# Altium schematic sheet 08-I225-1.SchDoc
size A3; SheetNumber: 7; SheetTotal: 15
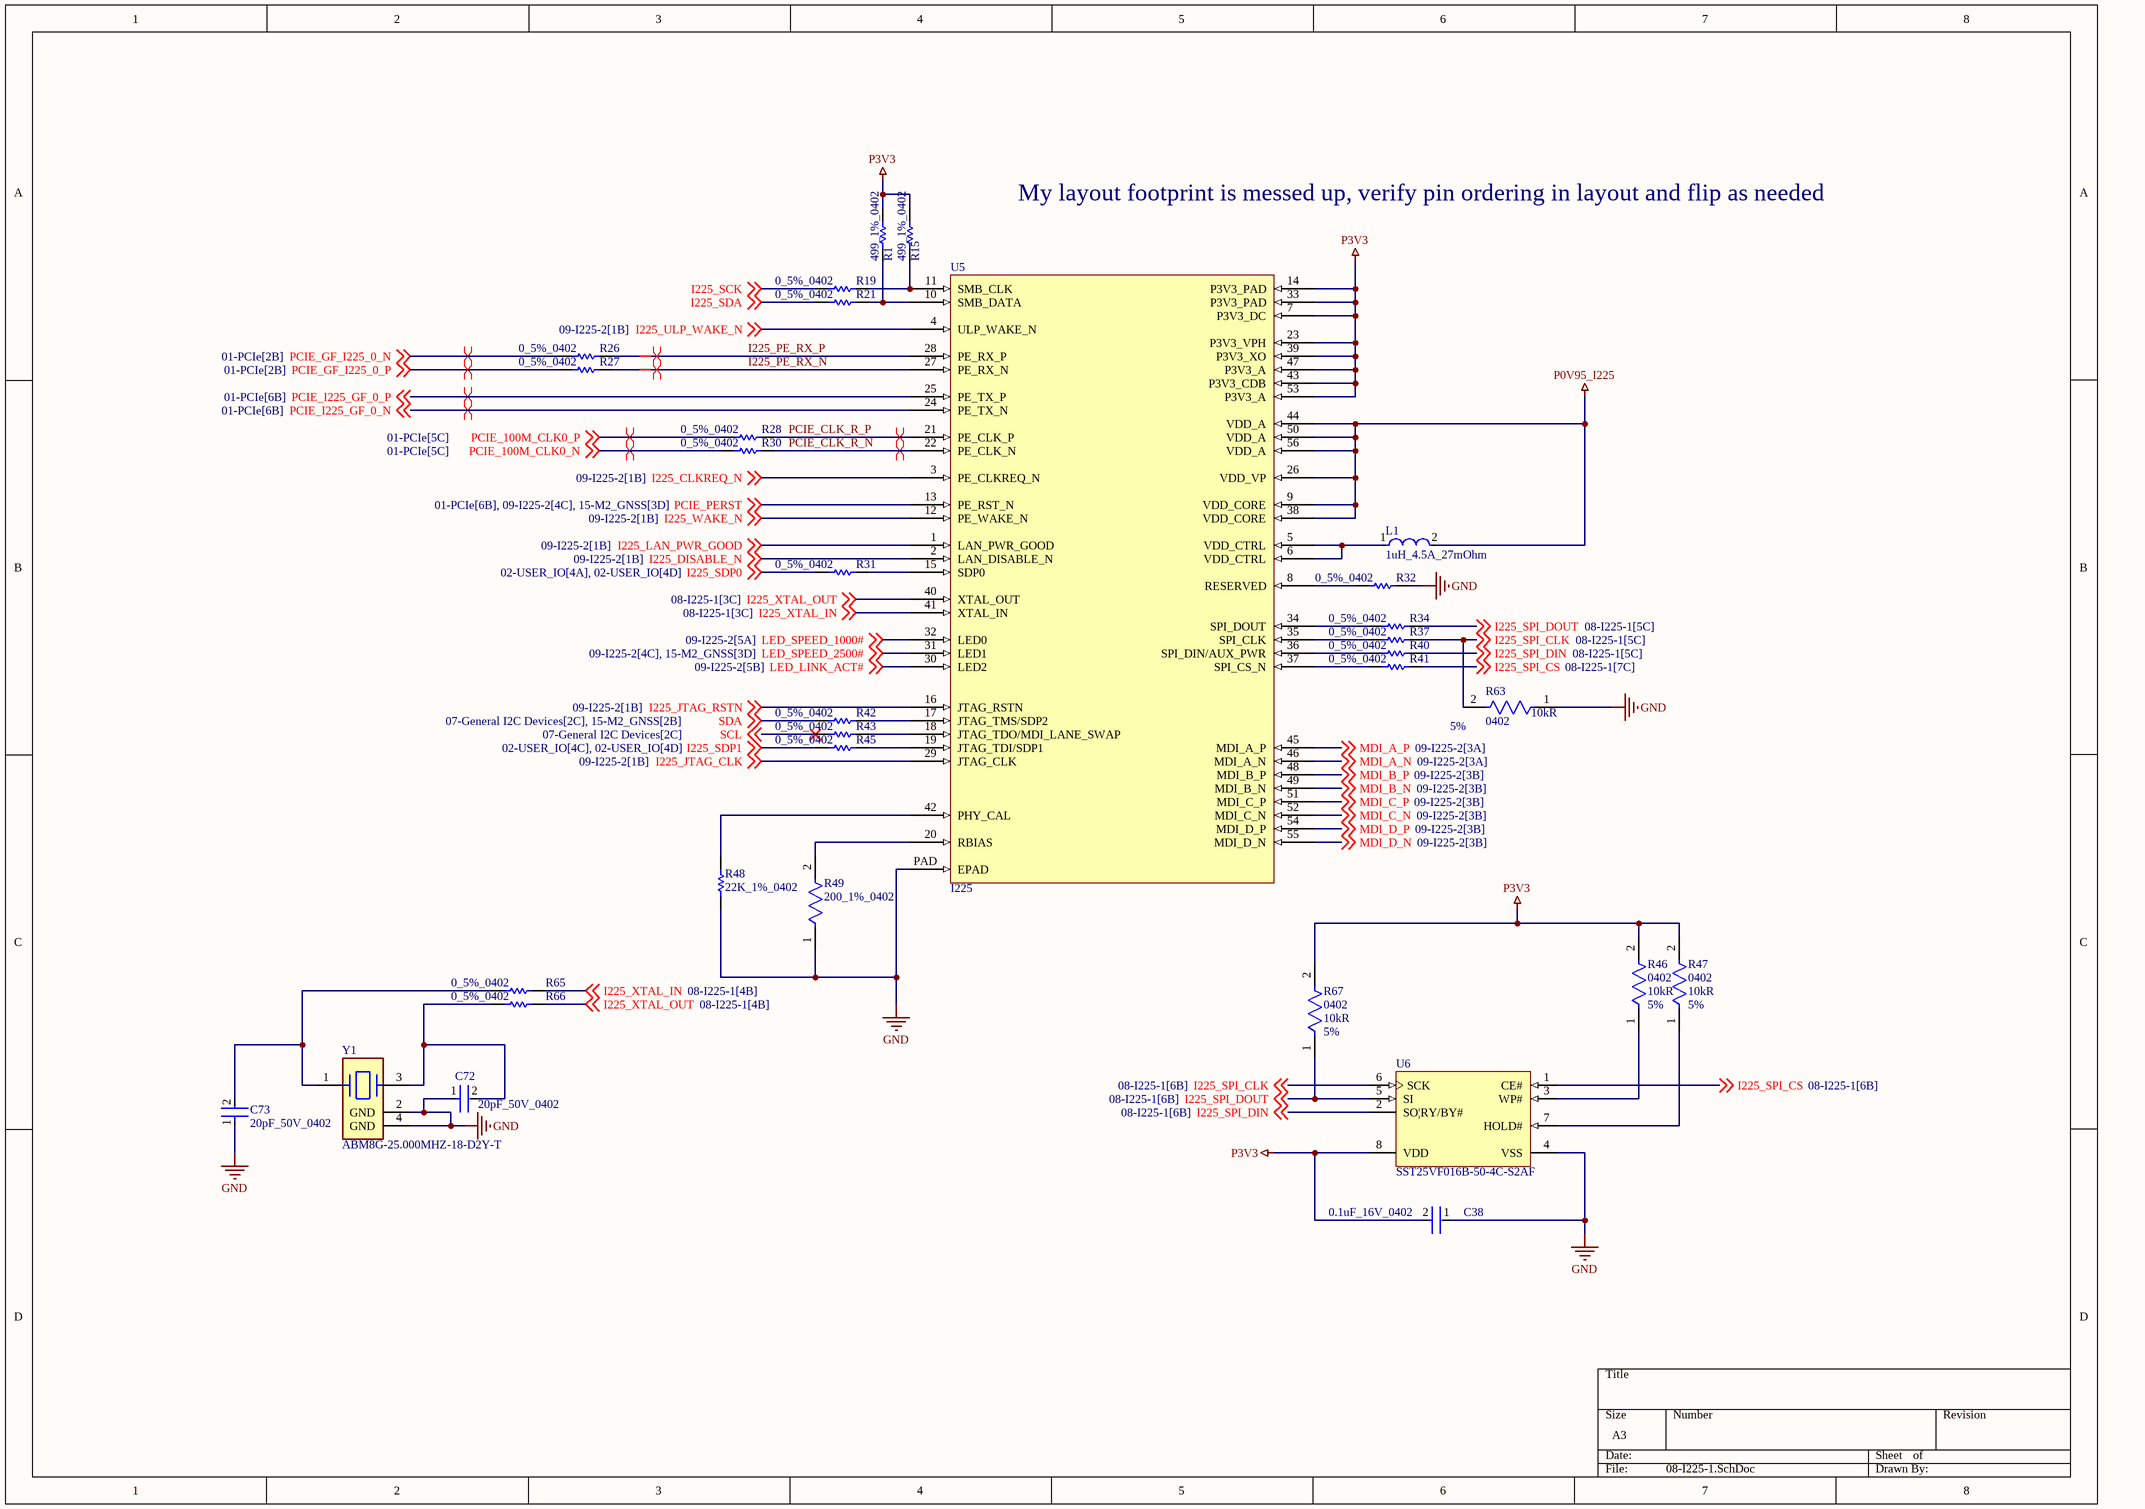
[diagram p0: 08-I225-1.SchDoc]

## Parts
C38  0.1uF_16V_0402  [FP-GRM15-MFG]
C72  20pF_50V_0402  [FP-C0402-BB-MFG]
C73  20pF_50V_0402  [FP-C0402-BB-MFG]
L1  1uH_4.5A_27mOhm  [FP-IHLP-1616BZ-FP_1_8545x-MFG]
R1  499_1%_0402  [RESC1005X40X25LL05T05]
R15  499_1%_0402  [RESC1005X40X25LL05T05]
R19  0_5%_0402  [RESC1005X40X25LL10T10]
R21  0_5%_0402  [RESC1005X40X25LL10T10]
R26  0_5%_0402  [RESC1005X40X25LL10T10]
R27  0_5%_0402  [RESC1005X40X25LL10T10]
R28  0_5%_0402  [RESC1005X40X25LL10T10]
R30  0_5%_0402  [RESC1005X40X25LL10T10]
R31  0_5%_0402  [RESC1005X40X25LL10T10]
R32  0_5%_0402  [RESC1005X40X25LL10T10]
R34  0_5%_0402  [RESC1005X40X25LL10T10]
R37  0_5%_0402  [RESC1005X40X25LL10T10]
R40  0_5%_0402  [RESC1005X40X25LL10T10]
R41  0_5%_0402  [RESC1005X40X25LL10T10]
R42  0_5%_0402  [RESC1005X40X25LL10T10]
R43  0_5%_0402  [RESC1005X40X25LL10T10]
R45  0_5%_0402  [RESC1005X40X25LL10T10]
R46  Case/Package: 0402  Resistance: 10kR  Tolerance: 5%  [FP-CRCW0402-e3-IPC_B]  (hidden comment: CRCW040210K0JNED)
R47  Case/Package: 0402  Resistance: 10kR  Tolerance: 5%  [FP-CRCW0402-e3-IPC_B]  (hidden comment: CRCW040210K0JNED)
R48  22K_1%_0402  [RESC1005X40X25NL05T05]
R49  200_1%_0402  [FP-CRCW0402-e3-IPC_C]
R63  Case/Package: 0402  Resistance: 10kR  Tolerance: 5%  [FP-CRCW0402-e3-IPC_B]  (hidden comment: CRCW040210K0JNED)
R65  0_5%_0402  [RESC1005X40X25LL10T10]
R66  0_5%_0402  [RESC1005X40X25LL10T10]
R67  Case/Package: 0402  Resistance: 10kR  Tolerance: 5%  [FP-CRCW0402-e3-IPC_B]  (hidden comment: CRCW040210K0JNED)
U5  I225  [I225 QFN56]
U6  SST25VF016B-50-4C-S2AF  [MCHP-SOIC-S2A8_M]
Y1  ABM8G-25.000MHZ-18-D2Y-T  [FP-ABM8G-MFG]

## Nets
GND: C38.1 C72.1 C73.1 R32.2 R48.1 R49.1 R63.1 U5.PAD(EPAD) U6.4(VSS) Y1.2(GND) Y1.4(GND)
P0V95_I225: L1.2 U5.9(VDD_CORE) U5.26(VDD_VP) U5.38(VDD_CORE) U5.44(VDD_A) U5.50(VDD_A) U5.56(VDD_A)
P3V3: C38.2 R1.2 R15.2 R46.2 R47.2 R67.2 U5.7(P3V3_DC) U5.14(P3V3_PAD) U5.23(P3V3_VPH) U5.33(P3V3_PAD) U5.39(P3V3_XO) U5.43(P3V3_CDB) U5.47(P3V3_A) U5.53(P3V3_A) U6.8(VDD)
I225_CLKREQ_N: U5.3(PE_CLKREQ_N) ; off-sheet I225_CLKREQ_N
I225_DISABLE_N: U5.2(LAN_DISABLE_N) ; off-sheet I225_DISABLE_N
I225_JTAG_CLK: U5.29(JTAG_CLK) ; off-sheet I225_JTAG_CLK
I225_JTAG_RSTN: U5.16(JTAG_RSTN) ; off-sheet I225_JTAG_RSTN
I225_LAN_PWR_GOOD: U5.1(LAN_PWR_GOOD) ; off-sheet I225_LAN_PWR_GOOD
I225_PE_RX_N: R27.2 U5.27(PE_RX_N)
I225_PE_RX_P: R26.2 U5.28(PE_RX_P)
I225_SCK: R19.1 ; off-sheet I225_SCK
I225_SDA: R21.1 ; off-sheet I225_SDA
I225_SDP0: R31.1 ; off-sheet I225_SDP0
I225_SDP1: R45.1 ; off-sheet I225_SDP1
I225_SPI_CLK: R37.2 R63.2 U6.6(SCK) ; off-sheet I225_SPI_CLK
I225_SPI_CS: R41.2 U6.1(CE#) ; off-sheet I225_SPI_CS
I225_SPI_DIN: R40.2 U6.2(SO|RY/BY#) ; off-sheet I225_SPI_DIN
I225_SPI_DOUT: R34.2 R67.1 U6.5(SI) ; off-sheet I225_SPI_DOUT
I225_ULP_WAKE_N: U5.4(ULP_WAKE_N) ; off-sheet I225_ULP_WAKE_N
I225_WAKE_N: U5.12(PE_WAKE_N) ; off-sheet I225_WAKE_N
I225_XTAL_IN: R65.2 U5.41(XTAL_IN) ; off-sheet I225_XTAL_IN
I225_XTAL_OUT: R66.2 U5.40(XTAL_OUT) ; off-sheet I225_XTAL_OUT
LED_LINK_ACT#: U5.30(LED2) ; off-sheet LED_LINK_ACT#
LED_SPEED_1000#: U5.32(LED0) ; off-sheet LED_SPEED_1000#
LED_SPEED_2500#: U5.31(LED1) ; off-sheet LED_SPEED_2500#
MDI_A_N: U5.46(MDI_A_N) ; off-sheet MDI_A_N
MDI_A_P: U5.45(MDI_A_P) ; off-sheet MDI_A_P
MDI_B_N: U5.49(MDI_B_N) ; off-sheet MDI_B_N
MDI_B_P: U5.48(MDI_B_P) ; off-sheet MDI_B_P
MDI_C_N: U5.52(MDI_C_N) ; off-sheet MDI_C_N
MDI_C_P: U5.51(MDI_C_P) ; off-sheet MDI_C_P
MDI_D_N: U5.55(MDI_D_N) ; off-sheet MDI_D_N
MDI_D_P: U5.54(MDI_D_P) ; off-sheet MDI_D_P
PCIE_100M_CLK0_N: R30.1 ; off-sheet PCIE_100M_CLK0_N
PCIE_100M_CLK0_P: R28.1 ; off-sheet PCIE_100M_CLK0_P
PCIE_CLK_R_N: R30.2 U5.22(PE_CLK_N)
PCIE_CLK_R_P: R28.2 U5.21(PE_CLK_P)
PCIE_GF_I225_0_N: R26.1 ; off-sheet PCIE_GF_I225_0_N
PCIE_GF_I225_0_P: R27.1 ; off-sheet PCIE_GF_I225_0_P
PCIE_I225_GF_0_N: U5.24(PE_TX_N) ; off-sheet PCIE_I225_GF_0_N
PCIE_I225_GF_0_P: U5.25(PE_TX_P) ; off-sheet PCIE_I225_GF_0_P
PCIE_PERST: U5.13(PE_RST_N) ; off-sheet PCIE_PERST
SCL: R43.1 ; off-sheet SCL
SDA: R42.1 ; off-sheet SDA
NetC72_2: C72.2 R66.1 Y1.3
NetC73_2: C73.2 R65.1 Y1.1
NetL1_1: L1.1 U5.5(VDD_CTRL) U5.6(VDD_CTRL)
NetR1_1: R1.1 R21.2 U5.10(SMB_DATA)
NetR15_1: R15.1 R19.2 U5.11(SMB_CLK)
NetR31_2: R31.2 U5.15(SDP0)
NetR32_1: R32.1 U5.8(RESERVED)
NetR34_1: R34.1 U5.34(SPI_DOUT)
NetR37_1: R37.1 U5.35(SPI_CLK)
NetR40_1: R40.1 U5.36(SPI_DIN/AUX_PWR)
NetR41_1: R41.1 U5.37(SPI_CS_N)
NetR42_2: R42.2 U5.17(JTAG_TMS/SDP2)
NetR43_2: R43.2 U5.18(JTAG_TDO/MDI_LANE_SWAP)
NetR45_2: R45.2 U5.19(JTAG_TDI/SDP1)
NetR46_1: R46.1 U6.3(WP#)
NetR47_1: R47.1 U6.7(HOLD#)
NetR48_2: R48.2 U5.42(PHY_CAL)
NetR49_2: R49.2 U5.20(RBIAS)

## Layout directives
differential pair: I225_PE_RX_N, I225_PE_RX_P, PCIE_100M_CLK0_N, PCIE_100M_CLK0_P, PCIE_CLK_R_N, PCIE_CLK_R_P, PCIE_GF_I225_0_N, PCIE_GF_I225_0_P, PCIE_I225_GF_0_N, PCIE_I225_GF_0_P

## Notes on the sheet
- My layout footprint is messed up, verify pin ordering in layout and flip as needed

## Library data of the parts
C38 = CMP-2100-03641-2: CAP CER 0.1UF 16V X7R 0402; Manufacturer Part Number: GRM155R71C104KA88D; Manufacturer: Murata; Standoff Height: 0mm; Tolerance: 10%; Voltage Rating: 16Vdc; Material: Ceramic; Capacitance: 0.10μF; Value: 0.10μF; RoHS: TRUE; Temperature Characteristic: X7R; Octopart: https://octopart.com/grm155r71c104ka88d-murata-196880; Digikey Description: CAP CER 0.1UF 16V X7R 0402; Device Class L3: Ceramic Capacitors; Height: 0.55mm; ComponentLink2Description: Datasheet; Temperature Range Low: -55°C; Ipc Land Pattern Name: CAPC10050X219; ComponentLink2URL: https://search.murata.co.jp/Ceramy/image/img/A01X/G101/ENG/GRM155R71H471KA01-01A.pdf; Device Class L1: Passive Components; Lead Free: yes; Category: Cap; Package: GRM15; Temperature: -55°C to +125°C; Device Class L2: Capacitors; Temperature Range High: +125°C; Mouser Description: 0402 0.1 uF 16V ±10 % Tolerance X7R SMT Multilayer Ceramic Capacitor
C72 C73 = CMP-1034-00890-3: CAP CER 20PF 50V 5% NP0 0402; Manufacturer Part Number: C0402C200J5GACTU; Manufacturer: Kemet; Tolerance: 0.05; Material: Ceramic; Temperature Characteristic: C0G; Temperature Coefficient: 15%; Octopart: https://octopart.com/c0402c200j5gactu-kemet-9143900; ComponentLink2Description: Datasheet; RoHS: TRUE; Ipc Land Pattern Name: CAPC10050X50; Temperature: -55°C to +125°C; Lead Free: Yes; Mouser Description: Multilayer Ceramic Capacitors MLCC - SMD/SMT 50volts 20pF C0G 5%; Device Class L1: Passive Components; Category: Cap; Package: C0402-BB; Temperature Range High: +125°C; Voltage Rating: 50 V; Temperature Range Low: -55°C; Device Class L2: Capacitors; Device Class L3: Ceramic Capacitors; Height: 0.55mm; Capacitance: 20 pF; Value: 20 pF; ComponentLink2URL: https://content.kemet.com/datasheets/KEM_C1002_X7R_SMD.pdf; Digikey Description: CAP CER 20PF 50V 5% NP0 0402; Automotive: No
L1 = CMP-02424-000223-1: Fixed Inductors Commercial Low DCR Series SMT 1uH 4.5A 27mΩ 20%; DC Resistance (DCR): 27mR; Core Material: Ferrite; Test Frequency: 100kHz; Shielding: Shielded; Self Resonant Frequency: 64MHz; Saturation Current: 5A; Inductance Tolerance: 20%; Min Operating Temperature: -55°C; Lead Free: Lead Free; Inductance: 1uH; Contact Plating: Tin; Package Quantity: 4000; Military Standard: Not; Depth: 4.31mm; Tolerance: 20%; RMS Current (Irms): 4.5A; Packaging: Tape and Reel; Number of Pins: 1616; Case/Package: 1616; Termination: SMD/SMT; Height: 2mm; Current Rating: 4.5A; Case Code (Metric): 4040; Max Operating Temperature: 125°C; Case Code (Imperial): 1616; Max DC Current: 4.5A; Width: 0.16inch; Mount: Surface Mount; Length: 4.7mm; Radiation Hardening: No; Height - Seated (Max): 0.079inch
R1 R15 = CMP-2002-00965-1: Manufacturer: Panasonic; Part Number: ERJ-2RKF4990X
R19 R21 R26-R28 R30-R32 R34 R37 R40-R43 R45 R65 R66 = CMP-2002-04569-1: Manufacturer: KOA Speer; Part Number: RK73Z1ETTP
R46 R47 R63 R67 = CMP-2002-08136-3: RES Thick Film, 10kΩ, 5%, 0.063W, 200ppm/°C, 0402; Voltage Rating: 50V; Power Rating: 63mW; Military Standard: Not; Packaging: Tape and Reel; Case Code (Imperial): 0402; Min Operating Temperature: -55°C; Case Code (Metric): 1005; Temperature Coefficient: 200ppm/°C; Termination: SMD/SMT; Composition: Thick Film; Depth: 0.5mm; Number of Terminations: 2; Contact Plating: Tin; Height: 0.016inch; Width: 0.5mm; Max Operating Temperature: 155°C; Features: Automotive AEC-Q200; Length: 1mm; Radiation Hardening: No; Max Power Dissipation: 63mW; Mount: Surface Mount; Package Quantity: 1; Weight: 2.3E-05oz
R48 = CMP-1011-00659-2: Part Number: CRCW040222K0FKED; Manufacturer: Vishay Dale
R49 = CMP-1011-00429-3: RES Thick Film, 200Ω, 1%, 0.063W, 100ppm/°C, 0402; Max Power Dissipation: 63mW; Voltage Rating: 50V; Resistance: 200R; Termination: SMD/SMT; Weight: 2.3E-05oz; Case/Package: 0402; Contact Plating: Tin; Number of Pins: 2; Width: 0.5mm; Height: 0.35mm; Case Code (Metric): 1005; Military Standard: Not; Features: Automotive AEC-Q200; Power Rating: 63mW; Temperature Coefficient: 100ppm/°C; Tolerance: 1%; Lead Free: Lead Free; Depth: 0.5mm; Max Operating Temperature: 155°C; Min Operating Temperature: -55°C; Package Quantity: 10; Voltage Rating (DC): 50V; Composition: Thick Film; Mount: Surface Mount; Radiation Hardening: No; Length: 1mm; Packaging: Tape and Reel; Number of Terminations: 2; Case Code (Imperial): 0402
U6 = CMP-0378-00041-1: 16 Mbit SPI Serial Flash, 2.7 to 3.6 V, 50 MHz, 0 to 70 degC, 8-pin SOIC (S2A8), Tube; Manufacturer: Microchip; PackageReference: SOIC-S2A8; PackageVersion: Rev. A; ComponentLink3URL: http://ww1.microchip.com/downloads/en/DeviceDoc/25051A.pdf; ComponentLink1Description: Manufacturer URL; ComponentLink4URL: http://www.microchip.com/SST25VF016B; ComponentLink1URL: http://www.microchip.com; DatasheetVersion: Rev. A; ComponentLink2URL: http://ww1.microchip.com/downloads/en/DeviceDoc/25044A.pdf; PackageDescription: 8-Lead Plastic Small Outline Intergrated Circuit, 5.275 x 5.275 mm Body, 1.27 mm Pitch; PartNumber: SST25VF016B-50-4C-S2AF; ComponentLink3Description: Package Specification; ComponentLink2Description: Datasheet; Mounting Technology: Surface Mount; ComponentLink4Description: Product URL
Y1 = CMP-2000-05733-2: CRYSTAL 25.0000MHZ 18PF SMD; Manufacturer: Abracon; Stability: 30ppm; Frequency: 25MHz; Esr: 60Ω; Tolerance: 20ppm; Automotive: No; Series: ABM8G; Temperature Range High: +85°C; ComponentLink2URL: https://abracon.com/Resonators/ABM8G.pdf; RoHS: TRUE; Octopart: https://octopart.com/abm8g-25.000mhz-18-d2y-t-abracon-12676602; Package: ABM8G; Category: Crys; Device Class L2: Crystals / Oscillators; ComponentLink2Description: Datasheet; Manufacturer Part Number: ABM8G-25.000MHZ-18-D2Y-T; Height: 1mm; Lead Free: Yes; Digikey Description: CRYSTAL 25.0000MHZ 18PF SMD; Temperature Range Low: -40°C; Device Class L3: Crystals; Load Capacitance: 18pF; Temperature: -40°C to +85°C; Device Class L1: Passive Components; Mouser Description: Crystals 25.000MHz 18pF 30ppm -40C +85C